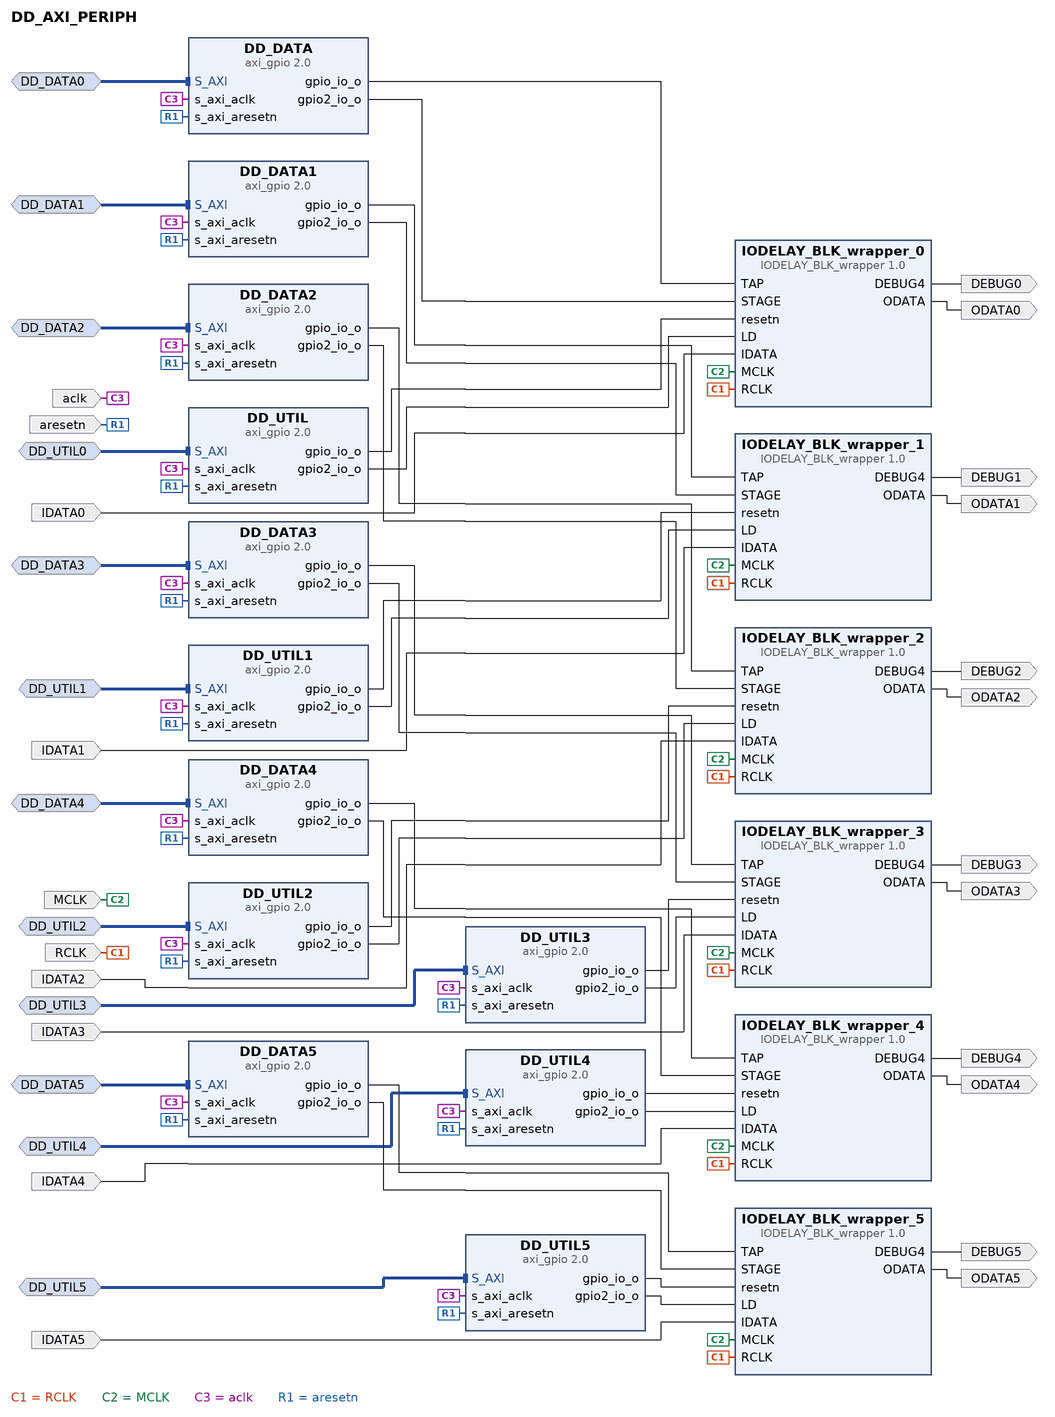
[diagram p0: block diagram of the top level]
# Vivado block design DD_AXI_PERIPH, xc7z020clg400-1, Vivado 2019.1
create_bd_design DD_AXI_PERIPH

create_bd_intf_port -mode Slave -vlnv xilinx.com:interface:aximm_tlm:1.0 DD_DATA0
create_bd_intf_port -mode Slave -vlnv xilinx.com:interface:aximm_tlm:1.0 DD_UTIL0
create_bd_intf_port -mode Slave -vlnv xilinx.com:interface:aximm_tlm:1.0 DD_DATA1
create_bd_intf_port -mode Slave -vlnv xilinx.com:interface:aximm_tlm:1.0 DD_UTIL1
create_bd_intf_port -mode Slave -vlnv xilinx.com:interface:aximm_tlm:1.0 DD_DATA2
create_bd_intf_port -mode Slave -vlnv xilinx.com:interface:aximm_tlm:1.0 DD_UTIL2
create_bd_intf_port -mode Slave -vlnv xilinx.com:interface:aximm_tlm:1.0 DD_DATA3
create_bd_intf_port -mode Slave -vlnv xilinx.com:interface:aximm_tlm:1.0 DD_UTIL3
create_bd_intf_port -mode Slave -vlnv xilinx.com:interface:aximm_tlm:1.0 DD_DATA4
create_bd_intf_port -mode Slave -vlnv xilinx.com:interface:aximm_tlm:1.0 DD_UTIL4
create_bd_intf_port -mode Slave -vlnv xilinx.com:interface:aximm_tlm:1.0 DD_DATA5
create_bd_intf_port -mode Slave -vlnv xilinx.com:interface:aximm_tlm:1.0 DD_UTIL5
create_bd_port -dir I -type clk MCLK
set_property -dict {CONFIG.FREQ_HZ 460000000} [get_bd_ports MCLK]
create_bd_port -dir I -type clk RCLK
set_property -dict {CONFIG.FREQ_HZ 310000000} [get_bd_ports RCLK]
create_bd_port -dir I IDATA0
create_bd_port -dir O ODATA0
create_bd_port -dir I aclk
create_bd_port -dir I aresetn
create_bd_port -dir I IDATA1
create_bd_port -dir O ODATA1
create_bd_port -dir O DEBUG0
create_bd_port -dir O DEBUG1
create_bd_port -dir O ODATA2
create_bd_port -dir O ODATA3
create_bd_port -dir O DEBUG2
create_bd_port -dir O DEBUG3
create_bd_port -dir I IDATA2
create_bd_port -dir I IDATA3
create_bd_port -dir I IDATA4
create_bd_port -dir I IDATA5
create_bd_port -dir O ODATA4
create_bd_port -dir O ODATA5
create_bd_port -dir O DEBUG4
create_bd_port -dir O DEBUG5

create_bd_cell -type ip -vlnv xilinx.com:ip:axi_gpio:2.0 DD_DATA
set_property -dict [list \
  CONFIG.C_ALL_OUTPUTS 1 \
  CONFIG.C_ALL_OUTPUTS_2 1 \
  CONFIG.C_GPIO2_WIDTH 4 \
  CONFIG.C_GPIO_WIDTH 5 \
  CONFIG.C_IS_DUAL 1 \
] [get_bd_cells DD_DATA]
create_bd_cell -type ip -vlnv xilinx.com:ip:axi_gpio:2.0 DD_UTIL
set_property -dict [list \
  CONFIG.C_ALL_OUTPUTS 1 \
  CONFIG.C_ALL_OUTPUTS_2 1 \
  CONFIG.C_DOUT_DEFAULT_2 0x00000001 \
  CONFIG.C_GPIO2_WIDTH 1 \
  CONFIG.C_GPIO_WIDTH 1 \
  CONFIG.C_IS_DUAL 1 \
] [get_bd_cells DD_UTIL]
create_bd_cell -type ip -vlnv xilinx.com:ip:axi_gpio:2.0 DD_DATA1
set_property -dict [list \
  CONFIG.C_ALL_OUTPUTS 1 \
  CONFIG.C_ALL_OUTPUTS_2 1 \
  CONFIG.C_GPIO2_WIDTH 4 \
  CONFIG.C_GPIO_WIDTH 5 \
  CONFIG.C_IS_DUAL 1 \
] [get_bd_cells DD_DATA1]
create_bd_cell -type ip -vlnv xilinx.com:ip:axi_gpio:2.0 DD_UTIL1
set_property -dict [list \
  CONFIG.C_ALL_OUTPUTS 1 \
  CONFIG.C_ALL_OUTPUTS_2 1 \
  CONFIG.C_DOUT_DEFAULT_2 0x00000001 \
  CONFIG.C_GPIO2_WIDTH 1 \
  CONFIG.C_GPIO_WIDTH 1 \
  CONFIG.C_IS_DUAL 1 \
] [get_bd_cells DD_UTIL1]
create_bd_cell -type ip -vlnv cri.nz:user:IODELAY_BLK_wrapper:1.0 IODELAY_BLK_wrapper_0
create_bd_cell -type ip -vlnv cri.nz:user:IODELAY_BLK_wrapper:1.0 IODELAY_BLK_wrapper_1
create_bd_cell -type ip -vlnv cri.nz:user:IODELAY_BLK_wrapper:1.0 IODELAY_BLK_wrapper_2
create_bd_cell -type ip -vlnv cri.nz:user:IODELAY_BLK_wrapper:1.0 IODELAY_BLK_wrapper_3
create_bd_cell -type ip -vlnv xilinx.com:ip:axi_gpio:2.0 DD_DATA2
set_property -dict [list \
  CONFIG.C_ALL_OUTPUTS 1 \
  CONFIG.C_ALL_OUTPUTS_2 1 \
  CONFIG.C_GPIO2_WIDTH 4 \
  CONFIG.C_GPIO_WIDTH 5 \
  CONFIG.C_IS_DUAL 1 \
] [get_bd_cells DD_DATA2]
create_bd_cell -type ip -vlnv xilinx.com:ip:axi_gpio:2.0 DD_UTIL2
set_property -dict [list \
  CONFIG.C_ALL_OUTPUTS 1 \
  CONFIG.C_ALL_OUTPUTS_2 1 \
  CONFIG.C_DOUT_DEFAULT_2 0x00000001 \
  CONFIG.C_GPIO2_WIDTH 1 \
  CONFIG.C_GPIO_WIDTH 1 \
  CONFIG.C_IS_DUAL 1 \
] [get_bd_cells DD_UTIL2]
create_bd_cell -type ip -vlnv xilinx.com:ip:axi_gpio:2.0 DD_DATA3
set_property -dict [list \
  CONFIG.C_ALL_OUTPUTS 1 \
  CONFIG.C_ALL_OUTPUTS_2 1 \
  CONFIG.C_GPIO2_WIDTH 4 \
  CONFIG.C_GPIO_WIDTH 5 \
  CONFIG.C_IS_DUAL 1 \
] [get_bd_cells DD_DATA3]
create_bd_cell -type ip -vlnv xilinx.com:ip:axi_gpio:2.0 DD_UTIL3
set_property -dict [list \
  CONFIG.C_ALL_OUTPUTS 1 \
  CONFIG.C_ALL_OUTPUTS_2 1 \
  CONFIG.C_DOUT_DEFAULT_2 0x00000001 \
  CONFIG.C_GPIO2_WIDTH 1 \
  CONFIG.C_GPIO_WIDTH 1 \
  CONFIG.C_IS_DUAL 1 \
] [get_bd_cells DD_UTIL3]
create_bd_cell -type ip -vlnv cri.nz:user:IODELAY_BLK_wrapper:1.0 IODELAY_BLK_wrapper_4
create_bd_cell -type ip -vlnv cri.nz:user:IODELAY_BLK_wrapper:1.0 IODELAY_BLK_wrapper_5
create_bd_cell -type ip -vlnv xilinx.com:ip:axi_gpio:2.0 DD_DATA4
set_property -dict [list \
  CONFIG.C_ALL_OUTPUTS 1 \
  CONFIG.C_ALL_OUTPUTS_2 1 \
  CONFIG.C_GPIO2_WIDTH 4 \
  CONFIG.C_GPIO_WIDTH 5 \
  CONFIG.C_IS_DUAL 1 \
] [get_bd_cells DD_DATA4]
create_bd_cell -type ip -vlnv xilinx.com:ip:axi_gpio:2.0 DD_UTIL4
set_property -dict [list \
  CONFIG.C_ALL_OUTPUTS 1 \
  CONFIG.C_ALL_OUTPUTS_2 1 \
  CONFIG.C_DOUT_DEFAULT_2 0x00000001 \
  CONFIG.C_GPIO2_WIDTH 1 \
  CONFIG.C_GPIO_WIDTH 1 \
  CONFIG.C_IS_DUAL 1 \
] [get_bd_cells DD_UTIL4]
create_bd_cell -type ip -vlnv xilinx.com:ip:axi_gpio:2.0 DD_DATA5
set_property -dict [list \
  CONFIG.C_ALL_OUTPUTS 1 \
  CONFIG.C_ALL_OUTPUTS_2 1 \
  CONFIG.C_GPIO2_WIDTH 4 \
  CONFIG.C_GPIO_WIDTH 5 \
  CONFIG.C_IS_DUAL 1 \
] [get_bd_cells DD_DATA5]
create_bd_cell -type ip -vlnv xilinx.com:ip:axi_gpio:2.0 DD_UTIL5
set_property -dict [list \
  CONFIG.C_ALL_OUTPUTS 1 \
  CONFIG.C_ALL_OUTPUTS_2 1 \
  CONFIG.C_DOUT_DEFAULT_2 0x00000001 \
  CONFIG.C_GPIO2_WIDTH 1 \
  CONFIG.C_GPIO_WIDTH 1 \
  CONFIG.C_IS_DUAL 1 \
] [get_bd_cells DD_UTIL5]

# ---- connections ----

connect_bd_intf_net -intf_net DD_DATA3_1 [get_bd_intf_ports DD_DATA3] [get_bd_intf_pins DD_DATA3/S_AXI]
connect_bd_intf_net -intf_net DD_UTIL2_1 [get_bd_intf_ports DD_UTIL2] [get_bd_intf_pins DD_UTIL2/S_AXI]
connect_bd_intf_net [get_bd_intf_ports DD_UTIL0] [get_bd_intf_pins DD_UTIL/S_AXI]
connect_bd_intf_net -intf_net DD_DATA1_1 [get_bd_intf_ports DD_DATA1] [get_bd_intf_pins DD_DATA1/S_AXI]
connect_bd_intf_net [get_bd_intf_ports DD_DATA0] [get_bd_intf_pins DD_DATA/S_AXI]
connect_bd_intf_net -intf_net DD_DATA2_1 [get_bd_intf_ports DD_DATA2] [get_bd_intf_pins DD_DATA2/S_AXI]
connect_bd_intf_net -intf_net DD_UTIL1_1 [get_bd_intf_ports DD_UTIL1] [get_bd_intf_pins DD_UTIL1/S_AXI]
connect_bd_intf_net -intf_net DD_UTIL3_1 [get_bd_intf_ports DD_UTIL3] [get_bd_intf_pins DD_UTIL3/S_AXI]
connect_bd_intf_net -intf_net DD_DATA4_1 [get_bd_intf_ports DD_DATA4] [get_bd_intf_pins DD_DATA4/S_AXI]
connect_bd_intf_net -intf_net DD_UTIL4_1 [get_bd_intf_ports DD_UTIL4] [get_bd_intf_pins DD_UTIL4/S_AXI]
connect_bd_intf_net -intf_net DD_UTIL5_1 [get_bd_intf_ports DD_UTIL5] [get_bd_intf_pins DD_UTIL5/S_AXI]
connect_bd_intf_net -intf_net DD_DATA5_1 [get_bd_intf_ports DD_DATA5] [get_bd_intf_pins DD_DATA5/S_AXI]
connect_bd_net -net axi_gpio_0_gpio_io_o [get_bd_pins DD_DATA/gpio_io_o] [get_bd_pins IODELAY_BLK_wrapper_0/TAP]
connect_bd_net -net axi_gpio_0_gpio2_io_o [get_bd_pins DD_DATA/gpio2_io_o] [get_bd_pins IODELAY_BLK_wrapper_0/STAGE]
connect_bd_net -net axi_gpio_0_gpio_io_o1 [get_bd_pins DD_UTIL/gpio_io_o] [get_bd_pins IODELAY_BLK_wrapper_0/resetn]
connect_bd_net -net axi_gpio_0_gpio2_io_o1 [get_bd_pins DD_UTIL/gpio2_io_o] [get_bd_pins IODELAY_BLK_wrapper_0/LD]
connect_bd_net [get_bd_ports RCLK] \
  [get_bd_pins IODELAY_BLK_wrapper_0/RCLK] [get_bd_pins IODELAY_BLK_wrapper_1/RCLK] [get_bd_pins IODELAY_BLK_wrapper_3/RCLK] \
  [get_bd_pins IODELAY_BLK_wrapper_2/RCLK] [get_bd_pins IODELAY_BLK_wrapper_4/RCLK] [get_bd_pins IODELAY_BLK_wrapper_5/RCLK]
connect_bd_net [get_bd_ports MCLK] \
  [get_bd_pins IODELAY_BLK_wrapper_0/MCLK] [get_bd_pins IODELAY_BLK_wrapper_1/MCLK] [get_bd_pins IODELAY_BLK_wrapper_2/MCLK] \
  [get_bd_pins IODELAY_BLK_wrapper_3/MCLK] [get_bd_pins IODELAY_BLK_wrapper_4/MCLK] [get_bd_pins IODELAY_BLK_wrapper_5/MCLK]
connect_bd_net [get_bd_ports IDATA0] [get_bd_pins IODELAY_BLK_wrapper_0/IDATA]
connect_bd_net [get_bd_pins IODELAY_BLK_wrapper_0/ODATA] [get_bd_ports ODATA0]
connect_bd_net [get_bd_ports aclk] \
  [get_bd_pins DD_UTIL/s_axi_aclk] [get_bd_pins DD_DATA/s_axi_aclk] [get_bd_pins DD_UTIL1/s_axi_aclk] \
  [get_bd_pins DD_DATA1/s_axi_aclk] [get_bd_pins DD_DATA2/s_axi_aclk] [get_bd_pins DD_UTIL2/s_axi_aclk] \
  [get_bd_pins DD_DATA3/s_axi_aclk] [get_bd_pins DD_UTIL3/s_axi_aclk] [get_bd_pins DD_DATA4/s_axi_aclk] \
  [get_bd_pins DD_UTIL4/s_axi_aclk] [get_bd_pins DD_DATA5/s_axi_aclk] [get_bd_pins DD_UTIL5/s_axi_aclk]
connect_bd_net [get_bd_ports aresetn] \
  [get_bd_pins DD_UTIL/s_axi_aresetn] [get_bd_pins DD_DATA/s_axi_aresetn] [get_bd_pins DD_UTIL1/s_axi_aresetn] \
  [get_bd_pins DD_DATA1/s_axi_aresetn] [get_bd_pins DD_DATA3/s_axi_aresetn] [get_bd_pins DD_UTIL3/s_axi_aresetn] \
  [get_bd_pins DD_UTIL2/s_axi_aresetn] [get_bd_pins DD_DATA2/s_axi_aresetn] [get_bd_pins DD_UTIL4/s_axi_aresetn] \
  [get_bd_pins DD_DATA4/s_axi_aresetn] [get_bd_pins DD_UTIL5/s_axi_aresetn] [get_bd_pins DD_DATA5/s_axi_aresetn]
connect_bd_net [get_bd_pins DD_DATA1/gpio_io_o] [get_bd_pins IODELAY_BLK_wrapper_1/TAP]
connect_bd_net [get_bd_pins DD_DATA1/gpio2_io_o] [get_bd_pins IODELAY_BLK_wrapper_1/STAGE]
connect_bd_net [get_bd_pins DD_UTIL1/gpio_io_o] [get_bd_pins IODELAY_BLK_wrapper_1/resetn]
connect_bd_net [get_bd_pins DD_UTIL1/gpio2_io_o] [get_bd_pins IODELAY_BLK_wrapper_1/LD]
connect_bd_net -net IDATA1_1 [get_bd_ports IDATA1] [get_bd_pins IODELAY_BLK_wrapper_1/IDATA]
connect_bd_net [get_bd_pins IODELAY_BLK_wrapper_1/ODATA] [get_bd_ports ODATA1]
connect_bd_net [get_bd_pins IODELAY_BLK_wrapper_0/DEBUG4] [get_bd_ports DEBUG0]
connect_bd_net [get_bd_pins IODELAY_BLK_wrapper_1/DEBUG4] [get_bd_ports DEBUG1]
connect_bd_net [get_bd_pins IODELAY_BLK_wrapper_2/ODATA] [get_bd_ports ODATA2]
connect_bd_net [get_bd_pins IODELAY_BLK_wrapper_3/ODATA] [get_bd_ports ODATA3]
connect_bd_net [get_bd_pins IODELAY_BLK_wrapper_2/DEBUG4] [get_bd_ports DEBUG2]
connect_bd_net [get_bd_pins IODELAY_BLK_wrapper_3/DEBUG4] [get_bd_ports DEBUG3]
connect_bd_net -net IDATA3_1 [get_bd_ports IDATA3] [get_bd_pins IODELAY_BLK_wrapper_3/IDATA]
connect_bd_net -net IDATA2_1 [get_bd_ports IDATA2] [get_bd_pins IODELAY_BLK_wrapper_2/IDATA]
connect_bd_net [get_bd_pins DD_UTIL2/gpio_io_o] [get_bd_pins IODELAY_BLK_wrapper_2/resetn]
connect_bd_net [get_bd_pins DD_UTIL2/gpio2_io_o] [get_bd_pins IODELAY_BLK_wrapper_2/LD]
connect_bd_net [get_bd_pins DD_DATA2/gpio_io_o] [get_bd_pins IODELAY_BLK_wrapper_2/TAP]
connect_bd_net [get_bd_pins DD_DATA2/gpio2_io_o] [get_bd_pins IODELAY_BLK_wrapper_2/STAGE]
connect_bd_net [get_bd_pins DD_UTIL3/gpio_io_o] [get_bd_pins IODELAY_BLK_wrapper_3/resetn]
connect_bd_net [get_bd_pins DD_UTIL3/gpio2_io_o] [get_bd_pins IODELAY_BLK_wrapper_3/LD]
connect_bd_net [get_bd_pins DD_DATA3/gpio_io_o] [get_bd_pins IODELAY_BLK_wrapper_3/TAP]
connect_bd_net [get_bd_pins DD_DATA3/gpio2_io_o] [get_bd_pins IODELAY_BLK_wrapper_3/STAGE]
connect_bd_net [get_bd_pins DD_DATA4/gpio_io_o] [get_bd_pins IODELAY_BLK_wrapper_4/TAP]
connect_bd_net [get_bd_pins DD_DATA4/gpio2_io_o] [get_bd_pins IODELAY_BLK_wrapper_4/STAGE]
connect_bd_net [get_bd_pins DD_UTIL4/gpio_io_o] [get_bd_pins IODELAY_BLK_wrapper_4/resetn]
connect_bd_net [get_bd_pins DD_UTIL4/gpio2_io_o] [get_bd_pins IODELAY_BLK_wrapper_4/LD]
connect_bd_net -net IDATA4_1 [get_bd_ports IDATA4] [get_bd_pins IODELAY_BLK_wrapper_4/IDATA]
connect_bd_net [get_bd_pins DD_DATA5/gpio_io_o] [get_bd_pins IODELAY_BLK_wrapper_5/TAP]
connect_bd_net [get_bd_pins DD_DATA5/gpio2_io_o] [get_bd_pins IODELAY_BLK_wrapper_5/STAGE]
connect_bd_net [get_bd_pins DD_UTIL5/gpio_io_o] [get_bd_pins IODELAY_BLK_wrapper_5/resetn]
connect_bd_net [get_bd_pins DD_UTIL5/gpio2_io_o] [get_bd_pins IODELAY_BLK_wrapper_5/LD]
connect_bd_net -net IDATA5_1 [get_bd_ports IDATA5] [get_bd_pins IODELAY_BLK_wrapper_5/IDATA]
connect_bd_net [get_bd_pins IODELAY_BLK_wrapper_4/ODATA] [get_bd_ports ODATA4]
connect_bd_net [get_bd_pins IODELAY_BLK_wrapper_5/ODATA] [get_bd_ports ODATA5]
connect_bd_net [get_bd_pins IODELAY_BLK_wrapper_4/DEBUG4] [get_bd_ports DEBUG4]
connect_bd_net [get_bd_pins IODELAY_BLK_wrapper_5/DEBUG4] [get_bd_ports DEBUG5]

validate_bd_design
save_bd_design
